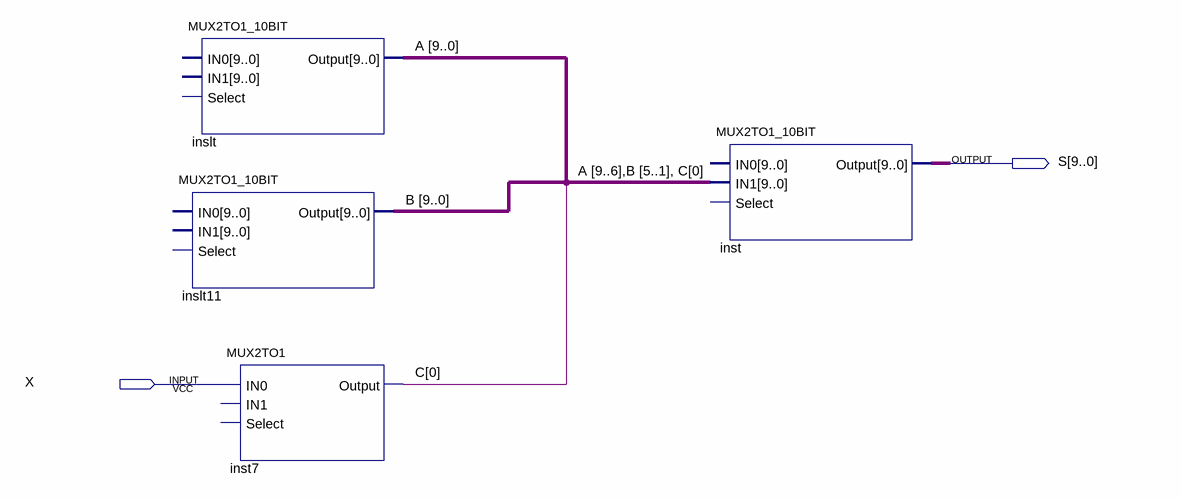
[diagram p0: schematic sheet]
// Quartus schematic tst.bdf as structural Verilog: 4 symbols, 2 pins
module tst (
  input  X,
  output [9:0] S
);

  wire [0:0] C;
  wire [9:0] A, B;

  MUX2TO1_10BIT inslt (.Output(A));  // open: IN0, IN1, Select
  MUX2TO1_10BIT inslt11 (.Output(B));  // open: IN0, IN1, Select
  MUX2TO1 inst7 (.IN0(X), .Output(C[0]));  // open: IN1, Select
  MUX2TO1_10BIT inst (.IN1({A[9:6], B[5:1], C[0]}), .Output(S));  // open: IN0, Select
endmodule
